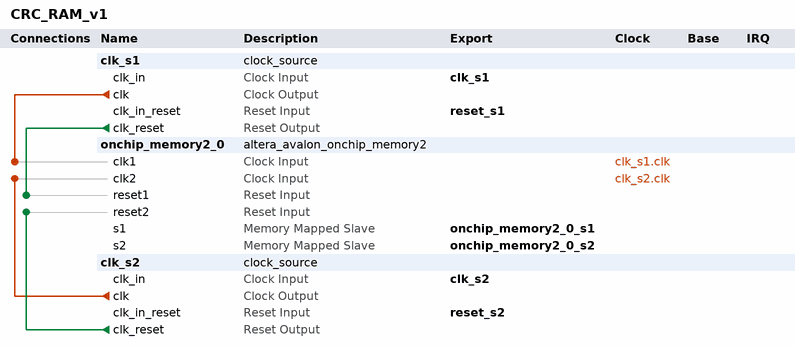
[diagram p0: system contents]
# Platform Designer (Qsys) system CRC_RAM_v1, MAX 10 10M50DAF484I7G
# Parameters at their usual value, and those the tool derives, are not listed.
package require -exact qsys 18.1
create_system CRC_RAM_v1
set_project_property DEVICE_FAMILY {MAX 10}
set_project_property DEVICE 10M50DAF484I7G

add_instance clk_s1 clock_source 18.1
set_instance_parameter_value clk_s1 clockFrequency 50000000

add_instance onchip_memory2_0 altera_avalon_onchip_memory2 18.1
set_instance_parameter_value onchip_memory2_0 dataWidth 8
set_instance_parameter_value onchip_memory2_0 dualPort true
set_instance_parameter_value onchip_memory2_0 initMemContent false
set_instance_parameter_value onchip_memory2_0 initializationFileName C:/DesignData/CoilDriverDesigns/Mk_7/USB_Controller/EB_Mk7_USB_Controller/ip/CRC_Table.hex
set_instance_parameter_value onchip_memory2_0 memorySize 256

add_instance clk_s2 clock_source 18.1
set_instance_parameter_value clk_s2 clockFrequency 50000000

# connections
add_connection clk_s1.clk onchip_memory2_0.clk1 clock
add_connection clk_s2.clk onchip_memory2_0.clk2 clock
add_connection clk_s1.clk_reset onchip_memory2_0.reset1 reset
add_connection clk_s2.clk_reset onchip_memory2_0.reset2 reset

# exported interfaces
add_interface clk_s1 clock sink
set_interface_property clk_s1 EXPORT_OF clk_s1.clk_in
add_interface clk_s2 clock sink
set_interface_property clk_s2 EXPORT_OF clk_s2.clk_in
add_interface onchip_memory2_0_s1 avalon slave
set_interface_property onchip_memory2_0_s1 EXPORT_OF onchip_memory2_0.s1
add_interface onchip_memory2_0_s2 avalon slave
set_interface_property onchip_memory2_0_s2 EXPORT_OF onchip_memory2_0.s2
add_interface reset_s1 reset sink
set_interface_property reset_s1 EXPORT_OF clk_s1.clk_in_reset
add_interface reset_s2 reset sink
set_interface_property reset_s2 EXPORT_OF clk_s2.clk_in_reset

set_interconnect_requirement {$system} qsys_mm.clockCrossingAdapter HANDSHAKE
set_interconnect_requirement {$system} qsys_mm.enableEccProtection FALSE
set_interconnect_requirement {$system} qsys_mm.insertDefaultSlave FALSE
set_interconnect_requirement {$system} qsys_mm.maxAdditionalLatency 1

save_system CRC_RAM_v1.qsys
